# EAGLE design LPC_Gira3 (EAGLE 5.02)
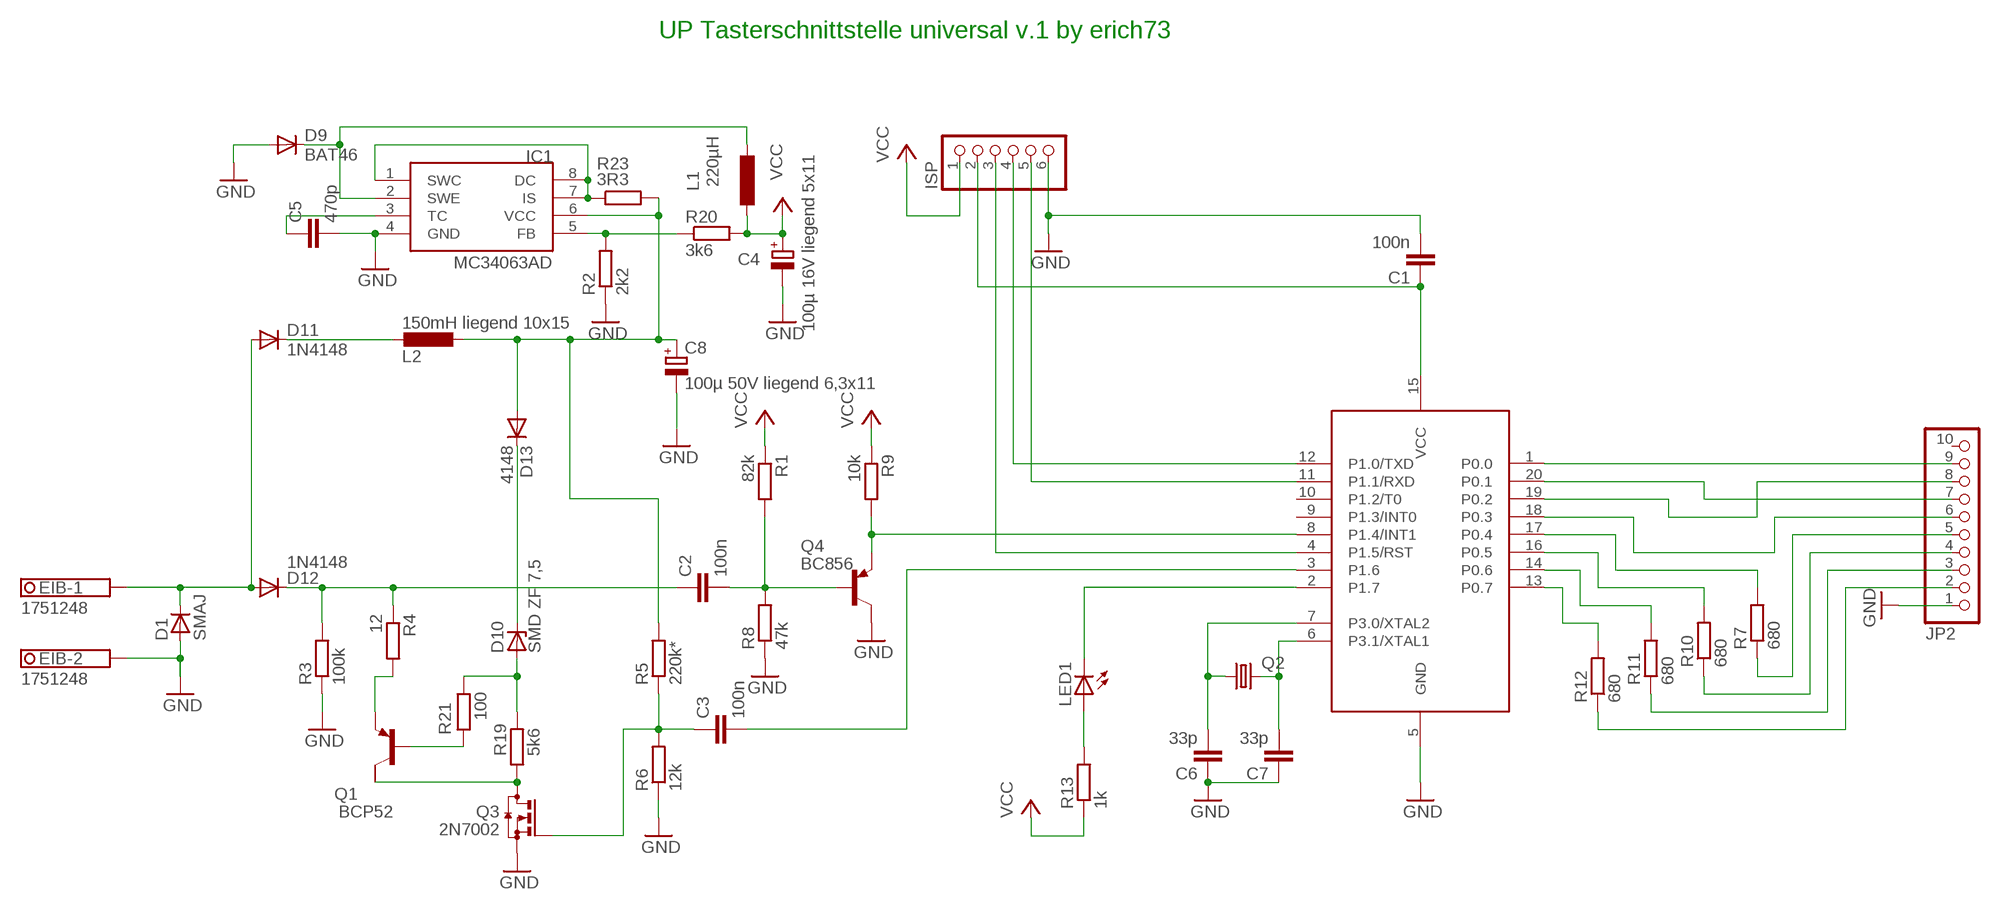
[diagram p0: schematic, sheet 1]

## Parts
C1  100n  C-EUC1206  [C1206]
C2  100n  C-EUC1206  [C1206]
C3  100n  C-EUC1206  [C1206]
C4  100µ 16V liegend 5x11  RCL_C_EU_H2-5X11  [2-5X11]
C5  470p  C-EUC1206  [C1206]
C6  33p  C-EUC0805  [C0805]
C7  33p  C-EUC0805  [C0805]
C8  100µ 50V liegend 6,3x11  RCL_C_EU_H3,5-6,3X11  [3,5-6,2X11]
D1  SMAJ  D-SMB  [SMB]
D9  BAT46  DIODE-MINIMELF  [MINIMELF]
D10  SMD ZF 7,5  ZPD  [MINIMELF]
D11  1N4148  DIODE-MINIMELF  [MINIMELF]
D12  1N4148  DIODE-MINIMELF  [MINIMELF]
D13  4148  DIODE-MINIMELF  [MINIMELF]
EIB  1751248  [1751248]
IC1  MC34063AD  [SOIC8]
ISP  PINHD-1X6_2.00  [1X06M]
JP2  PINHD-1X10  [1X10]
L1  220µH  L-EU2200-11.43  [2200-11.43]
L2  150mH liegend 10x15  RCL_L-11P11PH  [RCL_11PH]
LED1  LED3MM  [LED3MM]
Q1  BCP52  FZT753SMD  [SOT223]
Q2  CRYSTAL_CRYSTALHC49S  [CRYSTAL_HC49/S]
Q3  2N7002  BSS123  [SOT23]
Q4  BC856  BC856ALT1SMD  [SOT23-BEC]
R1  82k  R-EU_R1206  [R1206]
R2  2k2  R-EU_R1206  [R1206]
R3  100k  R-EU_M1206  [M1206]
R4  12  R-EU_R1206  [R1206]
R5  220k*  R-EU_R1206  [R1206]
R6  12k  R-EU_M1206  [M1206]
R7  680  R-EU_R0805  [R0805]
R8  47k  R-EU_M1206  [M1206]
R9  10k  R-EU_R1206  [R1206]
R10  680  R-EU_R0805  [R0805]
R11  680  R-EU_R0805  [R0805]
R12  680  R-EU_R0805  [R0805]
R13  1k  R-EU_M1206  [M1206]
R19  5k6  R-EU_M1206  [M1206]
R20  3k6  R-EU_M1206  [M1206]
R21  100  R-EU_R1206  [R1206]
R23  3R3  R-EU_M1206  [M1206]
U$4  LPC922FDH  [TSSOP20]

## Nets
GND: C1.2 C4.- C5.2 C6.1 C7.1 C8.- D1.2(A) D9.A EIB.2 IC1.4(GND) ISP.6 JP2.1 Q3.2(S) Q4.C R2.1 R3.1 R6.1 R8.1 U$4.5(GND)
N$1: C1.1 ISP.2 U$4.15(VCC)
N$2: ISP.3 U$4.4(P1.5/RST)
N$3: ISP.4 U$4.12(P1.0/TXD)
N$4: ISP.5 U$4.11(P1.1/RXD)
N$5: C7.2 Q2.2 U$4.6(P3.1/XTAL1)
N$6: C6.2 Q2.1 U$4.7(P3.0/XTAL2)
N$7: JP2.9 U$4.1(P0.0)
N$8: JP2.7 U$4.20(P0.1)
N$9: JP2.8 U$4.19(P0.2)
N$10: JP2.6 U$4.18(P0.3)
N$11: R7.2 U$4.17(P0.4)
N$12: C8.+ D13.A IC1.6(VCC) L2.P$1 R5.2 R23.2
N$13: JP2.5 R7.1
N$14: R10.2 U$4.16(P0.5)
N$15: R11.2 U$4.14(P0.6)
N$16: R12.2 U$4.13(P0.7)
N$17: JP2.4 R10.1
N$18: JP2.3 R11.1
N$19: Q4.E R9.2 U$4.8(P1.4/INT1)
N$20: JP2.2 R12.1
N$21: LED1.K(C) U$4.2(P1.7)
N$22: LED1.A R13.2
N$23: C2.2 Q4.B R1.2 R8.2
N$24: C3.2 U$4.3(P1.6)
N$25: C2.1 D12.C R3.2 R4.1
N$26: IC1.5(FB) R2.2 R20.1
N$27: D9.C IC1.2(SWE) L1.2
N$28: C5.1 IC1.3(TC)
N$34: C3.1 Q3.1(G) R5.1 R6.2
N$36: D11.C L2.P$2
N$37: Q1.2(C) Q3.3(D) R19.1
N$38: D10.A R19.2 R21.1
N$39: Q1.3(E) R4.2
N$40: Q1.1(B) R21.2
N$41: D10.C D13.C
N$51: D1.1(C) D11.A D12.A EIB.1
N$61: IC1.1(SWC) IC1.7(IS) IC1.8(DC) R23.1
VCC: C4.+ ISP.1 L1.1 R1.1 R9.1 R13.1 R20.2
Unconnected: JP2.10 Q1.4(C/) U$4.9(P1.3/INT0) U$4.10(P1.2/T0)

## Notes on the sheet
- UP Tasterschnittstelle universal v.1 by erich73

## Library data of the parts
C1-C3 C5-C7 = rcl:C-EU: CAPACITOR, European symbol
C4 C8 = LPC_Gira3:RCL_C_EU_H
D1 = semicon-smd-ipc:D-: DIODE unfilled
D9 D11-D13 = diode:DIODE-: DIODE
D10 = diode:ZPD: Z DIODE 500 mW
EIB = con-phoenix-350:1751248: MKDS 1/ 2-3,5 Printklemme Nennstrom: 10 A Bemessungsspannung: 160 V Raster: 3,5 mm Polzahl: 2 Montageart: Löten Anschlussart: Schraubanschluss Anschlussrichtung vom Leiter zur Platine: 0° Source: http://eshop.phoenixcontact.com .. 1751248.pdf
IC1 = mc34063:MC34063
ISP = pinhead2:PINHD-1X6: PIN HEADER
JP2 = pinhead:PINHD-1X10: PIN HEADER
L1 = rcl:L-EU: INDUCTOR, European symbol
L2 = LPC_Gira3:RCL_L-11P
LED1 = led:LED: LED OSRAM: - CHIPLED LG R971, LG N971, LY N971, LG Q971, LY Q971, LO R971, LY R971 LH N974, LH R974 LS Q976, LO Q976, LY Q976 LO Q996 - Hyper CHIPLED LW Q18S LB Q993, LB Q99A, LB R99A - SideLED LS A670, LO A670, LY A670, LG A670, LP A670 LB A673, LV A673, LT A673, LW A673 LH A674 LY A675 LS A676, LA A676, LO A676, LY A676, LW A676 LS A679, LY A679, LG A679 - Hyper Micro SIDELED® LS Y876, LA Y876, LO Y876, LY Y876 LT Y87S - SmartLED LW L88C, LW L88S LB L89C, LB L89S, LG L890 LS L89K, LO L89K, LY L89K LS L896, LA L896, LO L896, LY L896 - TOPLED LS T670, LO T670, LY T670, LG T670, LP T670 LSG T670, LSP T670, LSY T670, LOP T670, LYG T670 LG T671, LOG T671, LSG T671 LB T673, LV T673, LT T673, LW T673 LH T674 LS T676, LA T676, LO T676, LY T676, LB T676, LH T676, LSB T676, LW T676 LB T67C, LV T67C, LT T67C, LS T67K, LO T67K, LY T67K, LW E67C LS E67B, LA E67B, LO E67B, LY E67B, LB E67C, LV E67C, LT E67C LW T67C LS T679, LY T679, LG T679 LS T770, LO T770, LY T770, LG T770, LP T770 LB T773, LV T773, LT T773, LW T773 LH T774 LS E675, LA E675, LY E675, LS T675 LS T776, LA T776, LO T776, LY T776, LB T776 LHGB T686 LT T68C, LB T68C - Hyper Mini TOPLED® LB M676 - Mini TOPLED Santana® LG M470 LS M47K, LO M47K, LY M47K Source: http://www.osram.convergy.de - LUMILED® LXK2-PW12-R00, LXK2-PW12-S00, LXK2-PW14-U00, LXK2-PW14-V00 LXK2-PM12-R00, LXK2-PM12-S00, LXK2-PM14-U00 LXK2-PE12-Q00, LXK2-PE12-R00, LXK2-PE12-S00, LXK2-PE14-T00, LXK2-PE14-U00 LXK2-PB12-K00, LXK2-PB12-L00, LXK2-PB12-M00, LXK2-PB14-N00, LXK2-PB14-P00, LXK2-PB14-Q00 LXK2-PR12-L00, LXK2-PR12-M00, LXK2-PR14-Q00, LXK2-PR14-R00 LXK2-PD12-Q00, LXK2-PD12-R00, LXK2-PD12-S00 LXK2-PH12-R00, LXK2-PH12-S00 LXK2-PL12-P00, LXK2-PL12-Q00, LXK2-PL12-R00 Source: www.luxeon.com
Q1 = transistor-pnp:FZT753SMD: PNP Transistor
Q2 = LPCGira:CRYSTAL_CRYSTAL: CRYSTAL
Q3 = transistor-small-signal:BSS123: N-CHANNEL MOS FET
Q4 = transistor-pnp:BC856*: PNP Transistror
R1-R13 R19-R21 R23 = rcl:R-EU_: RESISTOR, European symbol
U$4 = LPCGira:LPC922FDH

## Board
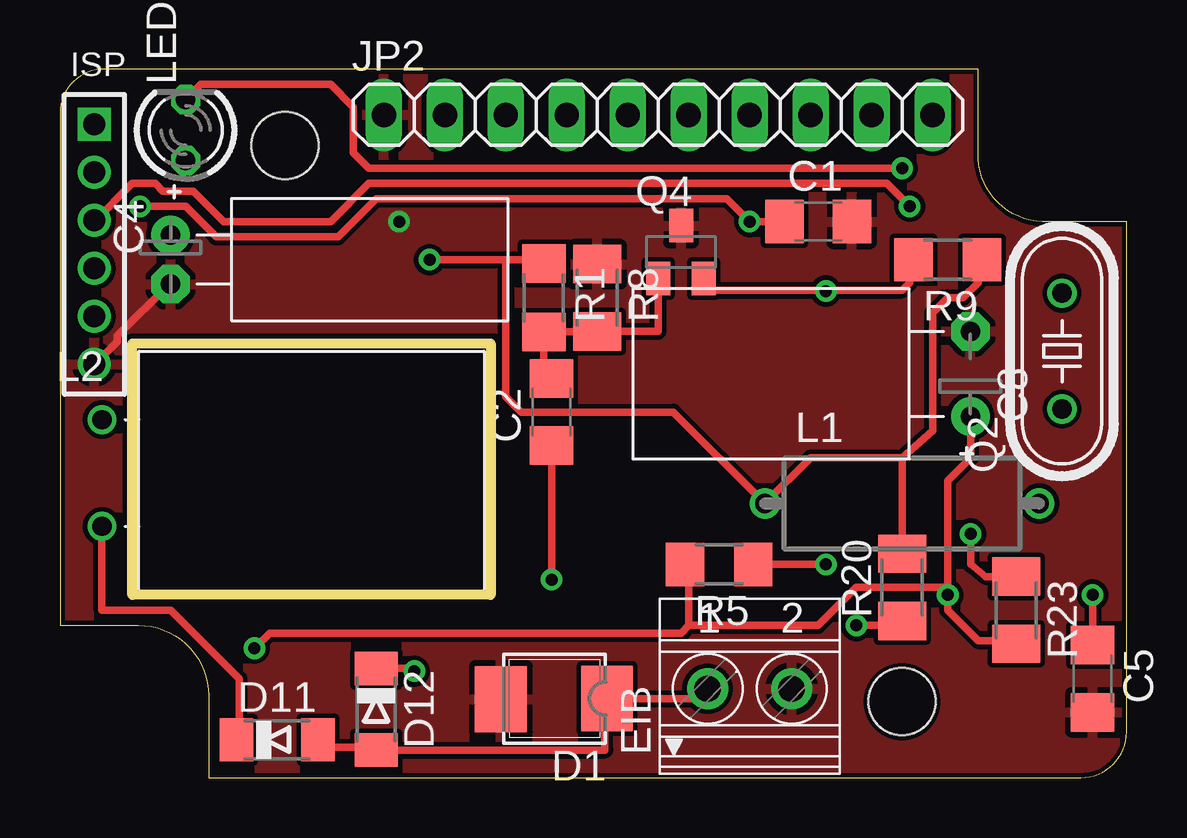
[diagram p1: board, top side]
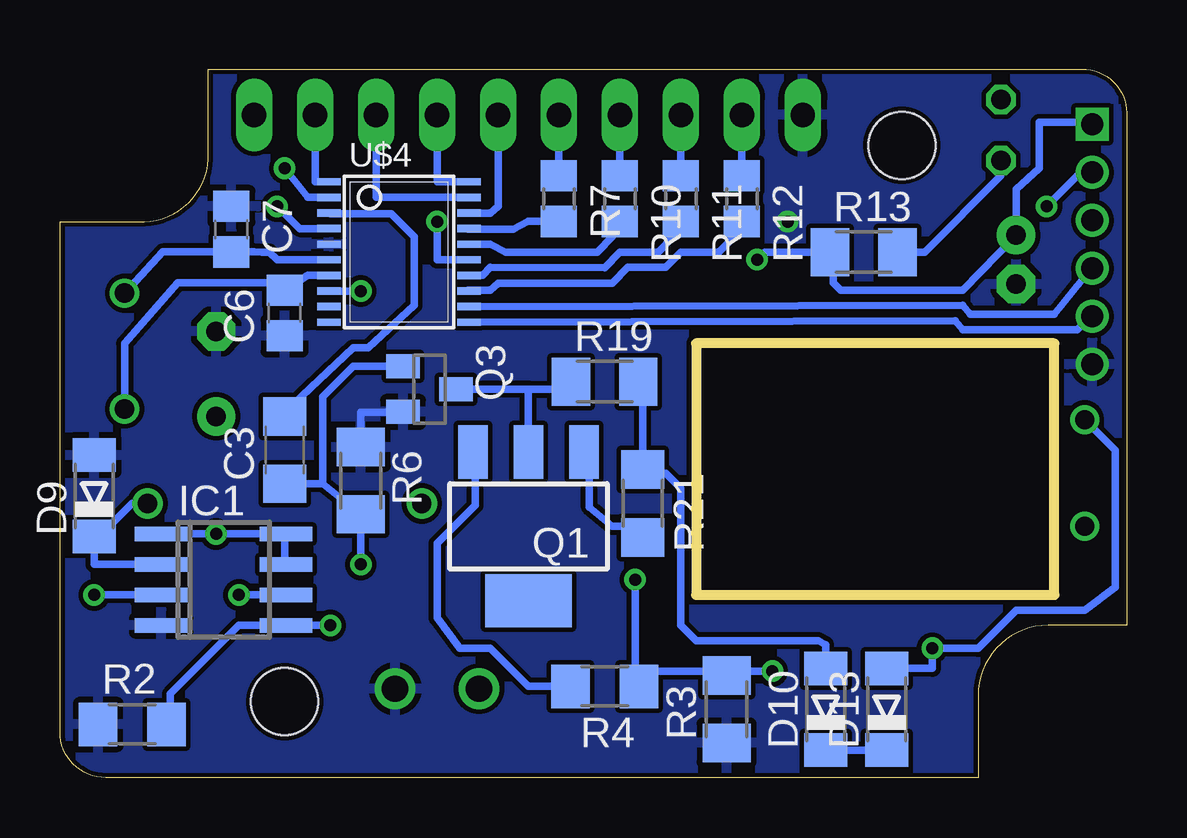
[diagram p2: board, bottom side, seen from below]

Size 44.44 x 29.53 mm. Coordinates in mm from the lower left corner, seen from the top.
Outline: 6.19,0 42.54,0.01 arc90 44.44,1.91 44.44,23.17 41.19,23.17 arc-90 38.26,25.79 38.26,29.53 1.69,29.52 arc90 0.01,27.53 0.01,6.35 3.26,6.35 arc-90 6.19,3.42 6.19,0
Outline: 3.02,18.1 17.94,18.1 17.94,7.62 3.02,7.62 3.02,18.1
Copper layers (1*16): Top 0.035mm / dielectric 1.5mm / Bottom 0.035mm
Design rules "ZWILLING": minimum track width 0.2mm, minimum drill 0.5mm, track to track 0.2mm, track to pad 0.2mm, pad to pad 0.2mm, via to via 0.2mm, smd to smd 0mil, copper to edge 0.2mm, drill to drill 0.2mm, minimum pad ring 0.2mm, minimum via ring 0.2mm, stop-mask expansion 0.1mm, vias tented up to drill 0mil, thermal gap 10mil
Holes 2.8 mm at 9.37,26.35 35.08,3.17

### Footprints (pad centres in the part's own frame; a part is rotated, then mirrored left to right if it is on the bottom)
C1206 = smd 1.6 x 1.8: 1 -1.4,0; 2 1.4,0
2-5X11 = drill 0.813 pad 1.6 round: + -1.02,0 | drill 0.813 pad 1.6 octagon: - 1.02,0
C0805 = smd 1.3 x 1.5: 1 -0.95,0; 2 0.95,0
3,5-6,2X11 = drill 0.813 pad 1.6 round: + -1.77,-0.31 | drill 0.813 pad 1.6 octagon: - 1.77,-0.31
SMB = smd 2.159 x 2.743: 1 -2.311,-0.127; 2 2.108,-0.102
MINIMELF = smd 1.4 x 1.8: A 1.7,0; C -1.7,0
1751248 = drill 1.1 pad 1.7 round: 1 -1.75,-0.1; 2 1.75,-0.1
SOIC8 = smd 0.6 x 2.2: 1 -1.905,-2.6; 2 -0.635,-2.6; 3 0.635,-2.6; 4 1.905,-2.6; 5 1.905,2.6; 6 0.635,2.6; 7 -0.635,2.6; 8 -1.905,2.6
1X06M = drill 0.914 square: 1 -5,0 | drill 0.914 round: 2 -3,0; 3 -1,0; 4 1,0; 5 3,0; 6 5,0
1X10 = drill 1.016 long: 1 -11.43,0; 2 -8.89,0; 3 -6.35,0; 4 -3.81,0; 5 -1.27,0; 6 1.27,0; 7 3.81,0; 8 6.35,0; 9 8.89,0; 10 11.43,0
2200-11.43 = drill 0.8 pad 1.27 round: 1 -5.715,0; 2 5.715,0
RCL_11PH = drill 0.8 round: P$1 -2.223,0; P$2 2.223,0
LED3MM = drill 0.813 octagon: A -1.27,0; K 1.27,0
SOT223 = smd 1.219 x 2.235: 1 -2.311,-3.099; 2 0,-3.099; 3 2.311,-3.099 | smd 3.6 x 2.2: 4 0,3.099
CRYSTAL_HC49/S = drill 0.813 round: 1 -2.413,0; 2 2.413,0
SOT23 = smd 1 x 1.4: 1 -0.95,-1.1; 2 0.95,-1.1; 3 0,1.1
SOT23-BEC = smd 1 x 1.4: B -0.95,-1.1; C 0,1.1; E 0.95,-1.1
R1206 = smd 1.6 x 1.803: 1 -1.422,0; 2 1.422,0
M1206 = smd 1.6 x 2: 1 -1.4,0; 2 1.4,0
R0805 = smd 1.3 x 1.5: 1 -0.95,0; 2 0.95,0
TSSOP20 = smd 0.305 x 0.991: 1 -2.925,-2.918; 2 -2.275,-2.918; 3 -1.625,-2.918; 4 -0.975,-2.918; 5 -0.325,-2.918; 6 0.325,-2.918; 7 0.975,-2.918; 8 1.625,-2.918; 9 2.275,-2.918; 10 2.925,-2.918; 11 2.925,2.918; 12 2.275,2.918; 13 1.625,2.918; 14 0.975,2.918; 15 0.325,2.918; 16 -0.325,2.918; 17 -0.975,2.918; 18 -1.625,2.918; 19 -2.275,2.918; 20 -2.925,2.918

### Placement (x,y rotation side)
C1  31.59,23.18 0 top
C2  20.48,15.24 90 top
C3  35.08,13.65 90 bottom
C4  4.6,21.59 270 top
C5  43.02,4.13 270 top
C6  35.08,19.37 90 bottom
C7  37.31,22.86 270 bottom
C8  37.62,16.83 90 top
D1  20.48,3.17 180 top
D9  43.02,11.75 90 bottom
D10  12.54,2.86 90 bottom
D11  9.05,1.59 0 top
D12  13.18,2.86 270 top
D13  10,2.86 90 bottom
EIB  28.73,3.81 0 top
IC1  37.62,8.26 270 bottom
ISP  1.43,22.23 270 top
JP2  24.92,27.62 0 top
L1  35.08,11.43 0 top
L2  1.75,12.7 270 top
LED1  5.24,26.99 90 top
Q1  24.92,10.48 180 bottom
Q2  41.75,17.78 90 top
Q3  29.05,16.19 270 bottom
Q4  25.88,21.91 0 top
R1  20.16,20 270 top
R2  41.43,2.22 0 bottom
R3  16.67,2.86 90 bottom
R4  21.75,3.81 180 bottom
R5  27.46,8.89 180 top
R6  31.91,12.38 270 bottom
R7  23.65,24.13 270 bottom
R8  22.38,20 270 top
R9  36.99,21.59 180 top
R10  21.11,24.13 270 bottom
R11  18.57,24.13 270 bottom
R12  16.03,24.13 270 bottom
R13  10.95,21.91 0 bottom
R19  21.75,16.51 0 bottom
R20  35.08,7.94 90 top
R21  20.16,11.43 270 bottom
R23  39.85,6.98 270 top
U$4  30.32,21.91 270 bottom

### Tracks (layer width: path | path; a pad name or v marks a point on that pad's centre or on a via)
GND  (via drill 0.5)
  Top 0.305: ISP.6 2.38,18.18 2.38,18.42 4.6,20.64 C4.-
  Bottom 0.2: Q3.2 30.32,15.24
  Bottom 0.305: 30.32,15.24 31.91,15.24 R6.1
  other vias: 14.13,23.18
  pour Bottom: -0.16,29.85 38.58,29.85 38.58,26.23 arc90 41.31,23.5 44.61,23.5 44.61,0 5.87,0 5.87,3.55 arc90 3.39,6.03 -0.16,6.03
  pour Top: -0.16,29.85 38.58,29.85 38.58,26.33 arc90 41.42,23.5 44.61,23.5 44.61,0 5.87,0 5.87,3.55 arc90 3.39,6.03 -0.16,6.03
N$1  (via drill 0.5)
  Top 0.305: v3.33,23.81 5.24,23.81 6.51,22.54 11.59,22.54 13.18,24.13 27.78,24.13 v28.73,23.18 C1.1
  Bottom 0.305: U$4.15 28.73,21.58 v28.73,23.18 | v3.33,23.81 2.06,25.08 1.43,25.08 ISP.2
N$2  (via drill 0.5)
  Top 0.305: v35.4,23.81 34.45,24.77 12.86,24.77 11.27,23.18 6.83,23.18 5.56,24.45 4.29,24.45 3.97,24.77 3.02,24.77 1.43,23.18 ISP.3
  Bottom 0.305: U$4.4 34.45,22.88 v35.4,23.81
N$3
  Bottom 0.305: U$4.12 6.83,19.69 6.51,19.32 3.02,19.32 1.43,21.27 ISP.4
N$4
  Bottom 0.305: 1.43,19.37 ISP.5 2.06,18.67 6.83,18.67 7.14,19.05 U$4.11
N$5
  Bottom 0.305: U$4.6 33.81,21.58 35.4,21.59 35.72,21.91 36.04,21.91 36.35,21.91 C7.2 40.16,21.91 Q2.2
N$6
  Bottom 0.305: U$4.7 34.13,20.93 C6.2 35.08,20.64 39.53,20.64 41.75,18.1 Q2.1
N$7
  Bottom 0.305: U$4.1 33.81,24.83 JP2.9
N$8
  Bottom 0.305: U$4.20 28.73,24.83 JP2.7
N$9
  Bottom 0.305: U$4.19 31.27,24.18 JP2.8
N$10
  Bottom 0.305: U$4.18 26.51,23.53 26.19,23.81 JP2.6
N$11
  Bottom 0.305: R7.2 23.65,23.2 24.92,23.2 25.56,22.86 27.46,22.86 27.46,22.88 U$4.17
N$12  (via drill 0.5)
  Top 0.305: R5.2 26.19,8.89 26.19,6.35 | v8.1,5.4 8.73,6.03 25.88,6.03 26.19,6.35 | 26.19,6.35 31.59,6.35 33.18,7.94 36.99,7.94 | 36.99,7.94 v36.99,7.62 36.99,6.98 38.26,5.71 39.85,5.71 R23.2 | 36.99,7.94 36.99,12.38 37.94,13.33 C8.+
  Bottom 0.305: v36.99,7.62 IC1.6 | D13.A 8.1,4.56 v8.1,5.4 6.19,5.4 4.6,6.98 1.75,6.98 0.48,7.94 0.48,13.65 L2.P$1
N$13
  Bottom 0.305: R7.1 JP2.5
N$14
  Bottom 0.305: U$4.16 26.51,22.23 25.88,21.91 22.07,21.91 21.43,22.54 21.43,23.18 R10.2
N$15
  Bottom 0.305: U$4.14 26.83,20.93 26.51,21.27 21.75,21.25 21.11,21.91 19.53,21.91 18.89,22.54 18.89,23.5 R11.2
N$16
  Bottom 0.305: R12.2 16.35,23.5 16.35,22.54 16.99,21.91 18.57,21.91 19.21,21.27 20.8,21.27 21.43,20.6 26.19,20.6 26.51,20.32 27.46,20.32 27.46,20.28 U$4.13
N$17
  Bottom 0.305: R10.1 JP2.4
N$18
  Bottom 0.305: R11.1 JP2.3
N$19  (via drill 0.5)
  Top 0.305: Q4.E 27.15,20.49 27.15,20.32 31.59,20.32 | 31.59,20.32 v31.91,20.28 | 31.59,20.32 35.08,20.32 35.4,20.64 35.4,21.59 R9.2
  Bottom 0.305: v31.91,20.28 U$4.8
N$20
  Bottom 0.305: R12.1 JP2.2
N$21  (via drill 0.5)
  Top 0.305: v35.08,25.4 12.86,25.4 12.22,26.04 12.22,27.94 11.27,28.89 5.87,28.89 LED1.K
  Bottom 0.305: U$4.2 34.13,24.18 v35.08,25.4
N$22
  Bottom 0.305: LED1.A 5.24,25.08 8.41,21.91 R13.2
N$23
  Top 0.305: R1.2 20.16,18.73 | C2.2 20.16,16.64 R1.2 | R1.2 22.38,18.58 R8.2 | R8.2 22.38,18.73 | Q4.B 24.92,20.49 24.92,18.6 R8.2
N$24
  Bottom 0.305: C3.2 35.08,15.24 32.23,17.91 31.59,17.91 29.69,19.69 29.69,22.54 30.64,23.5 33.18,23.5 33.18,23.53 U$4.3
N$25  (via drill 0.5)
  Top 0.2: 20.16,13.97 C2.1
  Top 0.305: D12.C 14.76,4.56 v14.76,4.45 | v20.48,8.26 20.48,13.65 20.16,13.97
  Bottom 0.305: 16.35,4.45 20.48,4.45 | 16.35,4.45 R3.2 | v14.76,4.45 16.35,4.45 | 20.48,4.45 R4.1 | 20.48,4.45 v20.48,8.26
N$26  (via drill 0.5)
  Top 0.305: v33.18,6.35 35.08,6.35 R20.1
  Bottom 0.305: 39.85,2.22 39.85,3.49 36.99,6.35 IC1.5 v33.18,6.35
  Bottom 0.406: 39.85,2.22 R2.2 | IC1.5 34.77,6.35
N$27
  Bottom 0.305: IC1.2 43.02,8.89 D9.C 43.02,10.48 42.39,10.48 41.43,11.43 L1.2
N$28  (via drill 0.5)
  Top 0.305: v43.02,7.62 C5.1
  Bottom 0.305: IC1.3 v43.02,7.62
N$34  (via drill 0.5)
  Top 0.305: R5.1 v31.91,8.89
  Bottom 0.305: 33.5,12.25 R6.2 v31.91,8.89 | 33.5,12.25 C3.1 34.77,12.7 | 33.5,12.25 33.5,15.88 32.23,17.14 Q3.1
N$36
  Top 0.305: D11.C 7.46,1.59 7.46,4.13 4.6,6.98 1.75,6.98 L2.P$2
N$37
  Bottom 0.305: 24.92,16.19 23.34,16.19 23.34,16.51 R19.1 | 24.92,16.19 Q3.3 | Q1.2 24.92,16.19
N$38
  Bottom 0.305: R19.2 20.16,16.51 R21.1 20.16,12.7 19.21,12.7 18.57,12.06 18.57,6.35 17.94,5.71 12.86,5.71 12.54,5.55 D10.A
N$39
  Bottom 0.305: R4.2 24.92,3.81 26.51,5.4 27.78,5.4 28.73,6.67 28.73,9.77 27.15,11.35 27.15,13.89 Q1.3
N$40
  Bottom 0.305: 22.38,13.89 22.38,13.97 | 22.38,13.89 Q1.1 | R21.2 20.16,10.48 21.43,10.48 22.38,11.28 22.38,13.89
N$41
  Bottom 0.305: D13.C D10.C 12.54,1.59
N$51
  Top 0.305: 10.32,1.59 D11.A | 22.7,3.3 22.7,1.16 D12.A | 22.7,3.3 D1.1 | 22.7,3.3 26.83,3.3 26.83,3.71 | 26.83,3.71 26.83,3.81 | 26.83,3.71 EIB.1 | 10.95,1.27 13.18,1.27
  Top 0.406: 13.18,1.27 D12.A | D11.A 10.95,1.59 10.95,1.27
N$61  (via drill 0.5)
  Top 0.305: R23.1 38.58,8.38 37.94,8.89 v37.94,10.16
  Bottom 0.305: 35.08,10.16 IC1.8 | IC1.7 35.08,8.89 35.08,10.16 | 35.08,10.16 v37.94,10.16 IC1.1
VCC  (via drill 0.5)
  Top 0.305: 35.08,13.33 R20.2 | 35.08,13.33 31.27,13.33 L1.1 25.56,15.24 19.21,15.24 18.57,15.88 18.57,21.59 | R9.1 38.26,21.59 38.26,20.64 37.62,20 36.99,20 36.35,19.37 36.35,14.45 35.08,13.33 | 18.57,21.59 20.16,21.59 R1.1 | v15.4,21.59 18.57,21.59
  Bottom 0.305: v15.4,21.59 15.08,21.91 R13.1 12.22,21.91 12.22,20.64 11.91,20.32 6.83,20.32 C4.+ 4.6,24.52 3.65,25.4 3.65,27.31 1.43,27.31 ISP.1